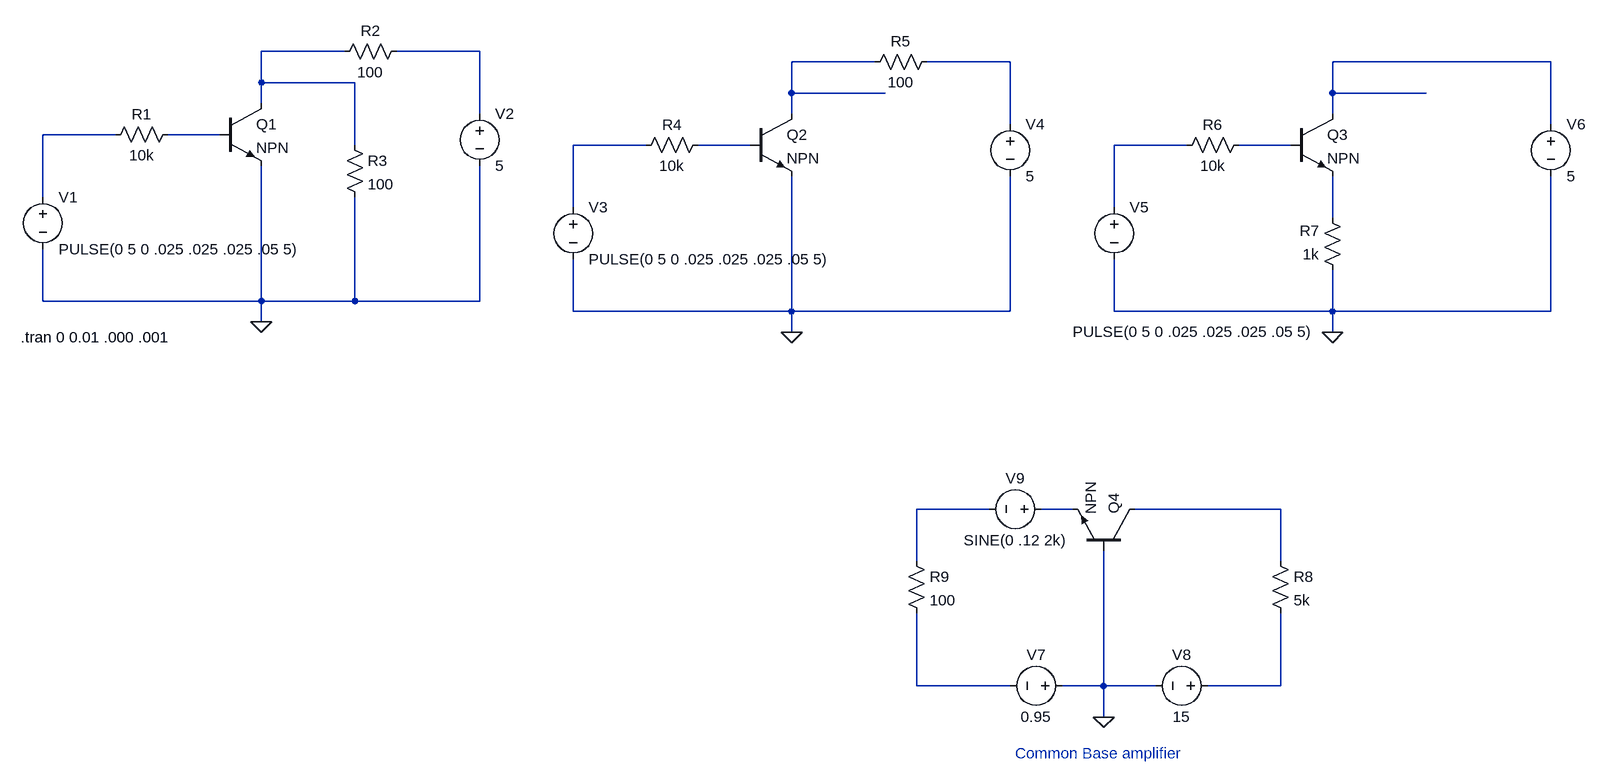
[diagram p0: schematic BJT Circuits.asc]
BJT Circuits.asc, the LTspice schematic file:
Version 4
SHEET 1 2360 1096
WIRE 448 0 320 0
WIRE 656 0 528 0
WIRE 1264 16 1136 16
WIRE 1472 16 1344 16
WIRE 2304 16 1968 16
WIRE 320 48 320 0
WIRE 464 48 320 48
WIRE 1136 64 1136 16
WIRE 1280 64 1136 64
WIRE 1968 64 1968 16
WIRE 2112 64 1968 64
WIRE 320 80 320 48
WIRE 656 96 656 0
WIRE 1136 96 1136 64
WIRE 1968 96 1968 64
WIRE 1472 112 1472 16
WIRE 2304 112 2304 16
WIRE 96 128 -16 128
WIRE 256 128 176 128
WIRE 464 144 464 48
WIRE 912 144 800 144
WIRE 1072 144 992 144
WIRE 1744 144 1632 144
WIRE 1904 144 1824 144
WIRE -16 224 -16 128
WIRE 800 240 800 144
WIRE 1632 240 1632 144
WIRE 1968 256 1968 192
WIRE -16 384 -16 304
WIRE 320 384 320 176
WIRE 320 384 -16 384
WIRE 464 384 464 224
WIRE 464 384 320 384
WIRE 656 384 656 176
WIRE 656 384 464 384
WIRE 800 400 800 320
WIRE 1136 400 1136 192
WIRE 1136 400 800 400
WIRE 1472 400 1472 192
WIRE 1472 400 1136 400
WIRE 1632 400 1632 320
WIRE 1968 400 1968 336
WIRE 1968 400 1632 400
WIRE 2304 400 2304 192
WIRE 2304 400 1968 400
WIRE 320 416 320 384
WIRE 1136 432 1136 400
WIRE 1968 432 1968 400
WIRE 1440 704 1328 704
WIRE 1568 704 1520 704
WIRE 1888 704 1664 704
WIRE 1328 784 1328 704
WIRE 1888 784 1888 704
WIRE 1328 976 1328 864
WIRE 1472 976 1328 976
WIRE 1616 976 1616 768
WIRE 1616 976 1552 976
WIRE 1696 976 1616 976
WIRE 1888 976 1888 864
WIRE 1888 976 1776 976
WIRE 1616 1024 1616 976
FLAG 320 416 0
FLAG 1136 432 0
FLAG 1968 432 0
FLAG 1616 1024 0
SYMBOL npn 256 80 R0
SYMATTR InstName Q1
SYMBOL res 192 112 R90
WINDOW 0 0 56 VBottom 2
WINDOW 3 32 56 VTop 2
SYMATTR InstName R1
SYMATTR Value 10k
SYMBOL res 544 -16 R90
WINDOW 0 0 56 VBottom 2
WINDOW 3 32 56 VTop 2
SYMATTR InstName R2
SYMATTR Value 100
SYMBOL voltage -16 208 R0
WINDOW 123 0 0 Left 0
WINDOW 39 0 0 Left 0
SYMATTR InstName V1
SYMATTR Value PULSE(0 5 0 .025 .025 .025 .05 5)
SYMBOL voltage 656 80 R0
WINDOW 123 0 0 Left 0
WINDOW 39 0 0 Left 0
SYMATTR InstName V2
SYMATTR Value 5
SYMBOL res 448 128 R0
SYMATTR InstName R3
SYMATTR Value 100
SYMBOL npn 1072 96 R0
SYMATTR InstName Q2
SYMBOL res 1008 128 R90
WINDOW 0 0 56 VBottom 2
WINDOW 3 32 56 VTop 2
SYMATTR InstName R4
SYMATTR Value 10k
SYMBOL res 1360 0 R90
WINDOW 0 0 56 VBottom 2
WINDOW 3 32 56 VTop 2
SYMATTR InstName R5
SYMATTR Value 100
SYMBOL voltage 800 224 R0
WINDOW 123 0 0 Left 0
WINDOW 39 0 0 Left 0
SYMATTR InstName V3
SYMATTR Value PULSE(0 5 0 .025 .025 .025 .05 5)
SYMBOL voltage 1472 96 R0
WINDOW 123 0 0 Left 0
WINDOW 39 0 0 Left 0
SYMATTR InstName V4
SYMATTR Value 5
SYMBOL npn 1904 96 R0
SYMATTR InstName Q3
SYMBOL res 1840 128 R90
WINDOW 0 0 56 VBottom 2
WINDOW 3 32 56 VTop 2
SYMATTR InstName R6
SYMATTR Value 10k
SYMBOL res 1984 352 R180
WINDOW 0 36 76 Left 2
WINDOW 3 36 40 Left 2
SYMATTR InstName R7
SYMATTR Value 1k
SYMBOL voltage 1632 224 R0
WINDOW 3 -64 207 Left 2
WINDOW 123 0 0 Left 0
WINDOW 39 0 0 Left 0
SYMATTR InstName V5
SYMATTR Value PULSE(0 5 0 .025 .025 .025 .05 5)
SYMBOL voltage 2304 96 R0
WINDOW 123 0 0 Left 0
WINDOW 39 0 0 Left 0
SYMATTR InstName V6
SYMATTR Value 5
SYMBOL voltage 1568 976 R90
WINDOW 0 -32 56 VBottom 2
WINDOW 3 32 56 VTop 2
WINDOW 123 0 0 Left 0
WINDOW 39 0 0 Left 0
SYMATTR InstName V7
SYMATTR Value 0.95
SYMBOL voltage 1792 976 R90
WINDOW 0 -32 56 VBottom 2
WINDOW 3 32 56 VTop 2
WINDOW 123 0 0 Left 0
WINDOW 39 0 0 Left 0
SYMATTR InstName V8
SYMATTR Value 15
SYMBOL res 1872 768 R0
SYMATTR InstName R8
SYMATTR Value 5k
SYMBOL res 1312 768 R0
SYMATTR InstName R9
SYMATTR Value 100
SYMBOL voltage 1536 704 R90
WINDOW 0 -32 56 VBottom 2
WINDOW 3 32 56 VTop 2
WINDOW 123 0 0 Left 0
WINDOW 39 0 0 Left 0
SYMATTR InstName V9
SYMATTR Value SINE(0 .12 2k)
SYMBOL npn 1664 768 M270
SYMATTR InstName Q4
TEXT -50 440 Left 2 !.tran 0 0.01 .000 .001
TEXT 1480 1080 Left 2 ;Common Base amplifier

The netlist it stands for:
* BJT Circuits.asc
Q1 N001 N007 0 0 NPN
R1 N007 N006 10k
R2 N002 N001 100
V1 N006 0 PULSE(0 5 0 .025 .025 .025 .05 5)
V2 N002 0 5
R3 N001 0 100
Q2 N003 N009 0 0 NPN
R4 N009 N008 10k
R5 N004 N003 100
V3 N008 0 PULSE(0 5 0 .025 .025 .025 .05 5)
V4 N004 0 5
Q3 N005 N011 N012 0 NPN
R6 N011 N010 10k
R7 0 N012 1k
V5 N010 0 PULSE(0 5 0 .025 .025 .025 .05 5)
V6 N005 0 5
V7 0 N016 0.95
V8 N017 0 15
R8 N015 N017 5k
R9 N013 N016 100
V9 N014 N013 SINE(0 .12 2k)
Q4 N015 0 N014 0 NPN
.model NPN NPN
.model PNP PNP
.lib standard.bjt
.tran 0 0.01 .000 .001
* Common Base amplifier
.backanno
.end